# Altium schematic sheet conn_usbc.SchDoc
size A
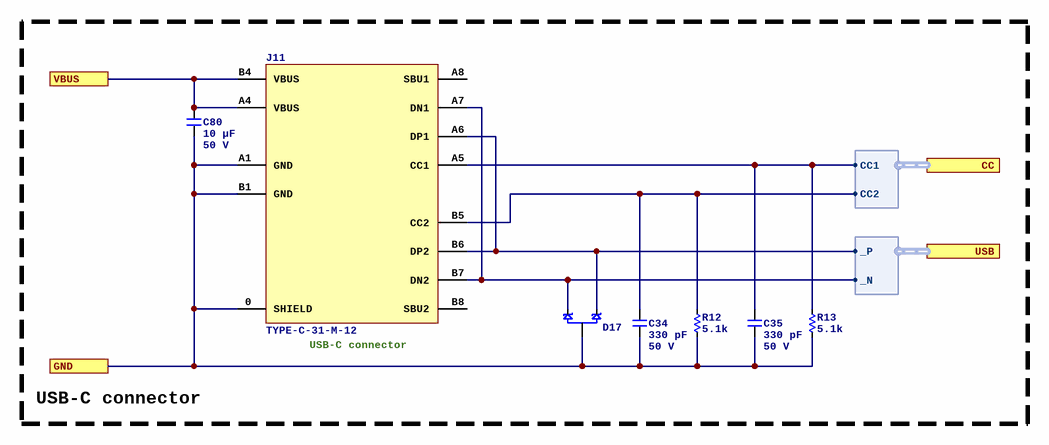
[diagram p0: conn_usbc.SchDoc]

## Parts
C34  Capacitance: 330 pF  Voltage Rating: 50 V  [C0402]  (hidden comment: CL05C331JB5NNNC)
C35  Capacitance: 330 pF  Voltage Rating: 50 V  [C0402]  (hidden comment: CL05C331JB5NNNC)
C80  Capacitance: 10 µF  Voltage Rating: 50 V  [C1206]  (hidden comment: CL31B106KBHNNNE)
D17  PESD2USB3UX  [3SOT23]  (value not drawn)
J11  TYPE-C-31-M-12  [CONN_USBC_TYPE-C-31-M-12]
R12  value 5.1k  [R0402]  (hidden comment: 0402WGF5101TCE)
R13  value 5.1k  [R0402]  (hidden comment: 0402WGF5101TCE)

## Ports
CC (harness CC), GND, USB (harness DIFF), VBUS

## Harnesses
DIFF: _P, _N
CC: CC2, CC1

## Nets
GND: C34.2 C35.2 C80.2 D17.3 J11.0(SHIELD) J11.A1(GND) J11.B1(GND) R12.2 R13.2 ; port GND
VBUS: C80.1 J11.A4(VBUS) J11.B4(VBUS) ; port VBUS
NetC34_1: C34.1 J11.B5(CC2) R12.1 ; port CC.CC2
NetC35_1: C35.1 J11.A5(CC1) R13.1 ; port CC.CC1
NetD17_1: D17.1 J11.A6(DP1) J11.B6(DP2) ; port USB._P
NetD17_2: D17.2 J11.A7(DN1) J11.B7(DN2) ; port USB._N

Not connected (* = marked no-connect by the designer): J11 A8(SBU1) B8(SBU2)

## Notes on the sheet
- USB-C connector
- (near J11) USB-C connector

## Library data of the parts
C34 C35 = CL05C331JB5NNNC: Manufacturer: Samsung Electro-Mechanics; Dielectric: C0G; ComponentLink1URL: https://wmsc.lcsc.com/wmsc/upload/file/pdf/v2/lcsc/2304140030_Samsung-Electro-Mechanics-CL05C331JB5NNNC_C13533.pdf; ComponentLink1Description: Datasheet; Manufacturer Part Number: CL05C331JB5NNNC; Package: 0402; Supplier 2: LCSC; Supplier Part Number 2: C13533
C80 = CL31B106KBHNNNE: Manufacturer: Samsung Electro-Mechanics; Dielectric: X7R; ComponentLink1URL: https://wmsc.lcsc.com/wmsc/upload/file/pdf/v2/lcsc/1810221111_Samsung-Electro-Mechanics-CL31B106KBHNNNE_C89632.pdf; ComponentLink1Description: Datasheet; Manufacturer Part Number: CL31B106KBHNNNE; Package: 1206; Supplier 2: LCSC; Supplier Part Number 2: C89632
D17 = PESD2USB3UX: DIODE ESD USB SOT-23; Manufacturer: Nexperia USA Inc.; Polarity: Unidirectional; Capacitance (pF): 0.7; Standoff (V): 3.3; Min Breakdown Voltage: 4.2 V; Supplier 1: DigiKey; Supplier Part Number 1: 1727-PESD2USB3UX-CT-ND; Manufacturer Part Number: PESD2USB3UX; Supplier 2: LCSC; Supplier Part Number 2: C3708426; ComponentLink1Description: Datasheet; ComponentLink1URL: https://assets.nexperia.com/documents/data-sheet/PESD2USB3UX-T.pdf; Supplier 3: Mouser; Supplier Part Number 3: 771-PESD2USB3UX-TR
J11 = TYPE-C-31-M-12: 5A 1 16P Female Type-C SMD USB Connectors ROHS; Manufacturer: HRO Electronics; ComponentLink1Description: Product page; ComponentLink1URL: https://en.krhro.com/Product-Details/726.html; ComponentLink2Description: Drawing; ComponentLink2URL: https://omo-oss-file.thefastfile.com/portal-saas/new2023011311465142457/cms/file/95f41c83-14fa-41cb-9f86-8d6a717317e5.pdf; Manufacturer Part Number: TYPE-C-31-M-12; Supplier 2: LCSC; Supplier Part Number 2: C165948
R12 R13 = 0402WGF5101TCE: Manufacturer: UNI-ROYAL(Uniroyal Elec); Tolerance: 1%; Temperature Coefficient: ±100ppm/?; Power Rating (mW): 62.5; ComponentLink1Description: Datasheet; ComponentLink1URL: https://wmsc.lcsc.com/wmsc/upload/file/pdf/v2/lcsc/2206010045_UNI-ROYAL-Uniroyal-Elec-0402WGF5101TCE_C25905.pdf; Manufacturer Part Number: 0402WGF5101TCE; Package: 0402; Supplier 2: LCSC; Supplier Part Number 2: C25905